# Altium schematic sheet Power.SchDoc
size A3; SheetNumber: 3; SheetTotal: 11
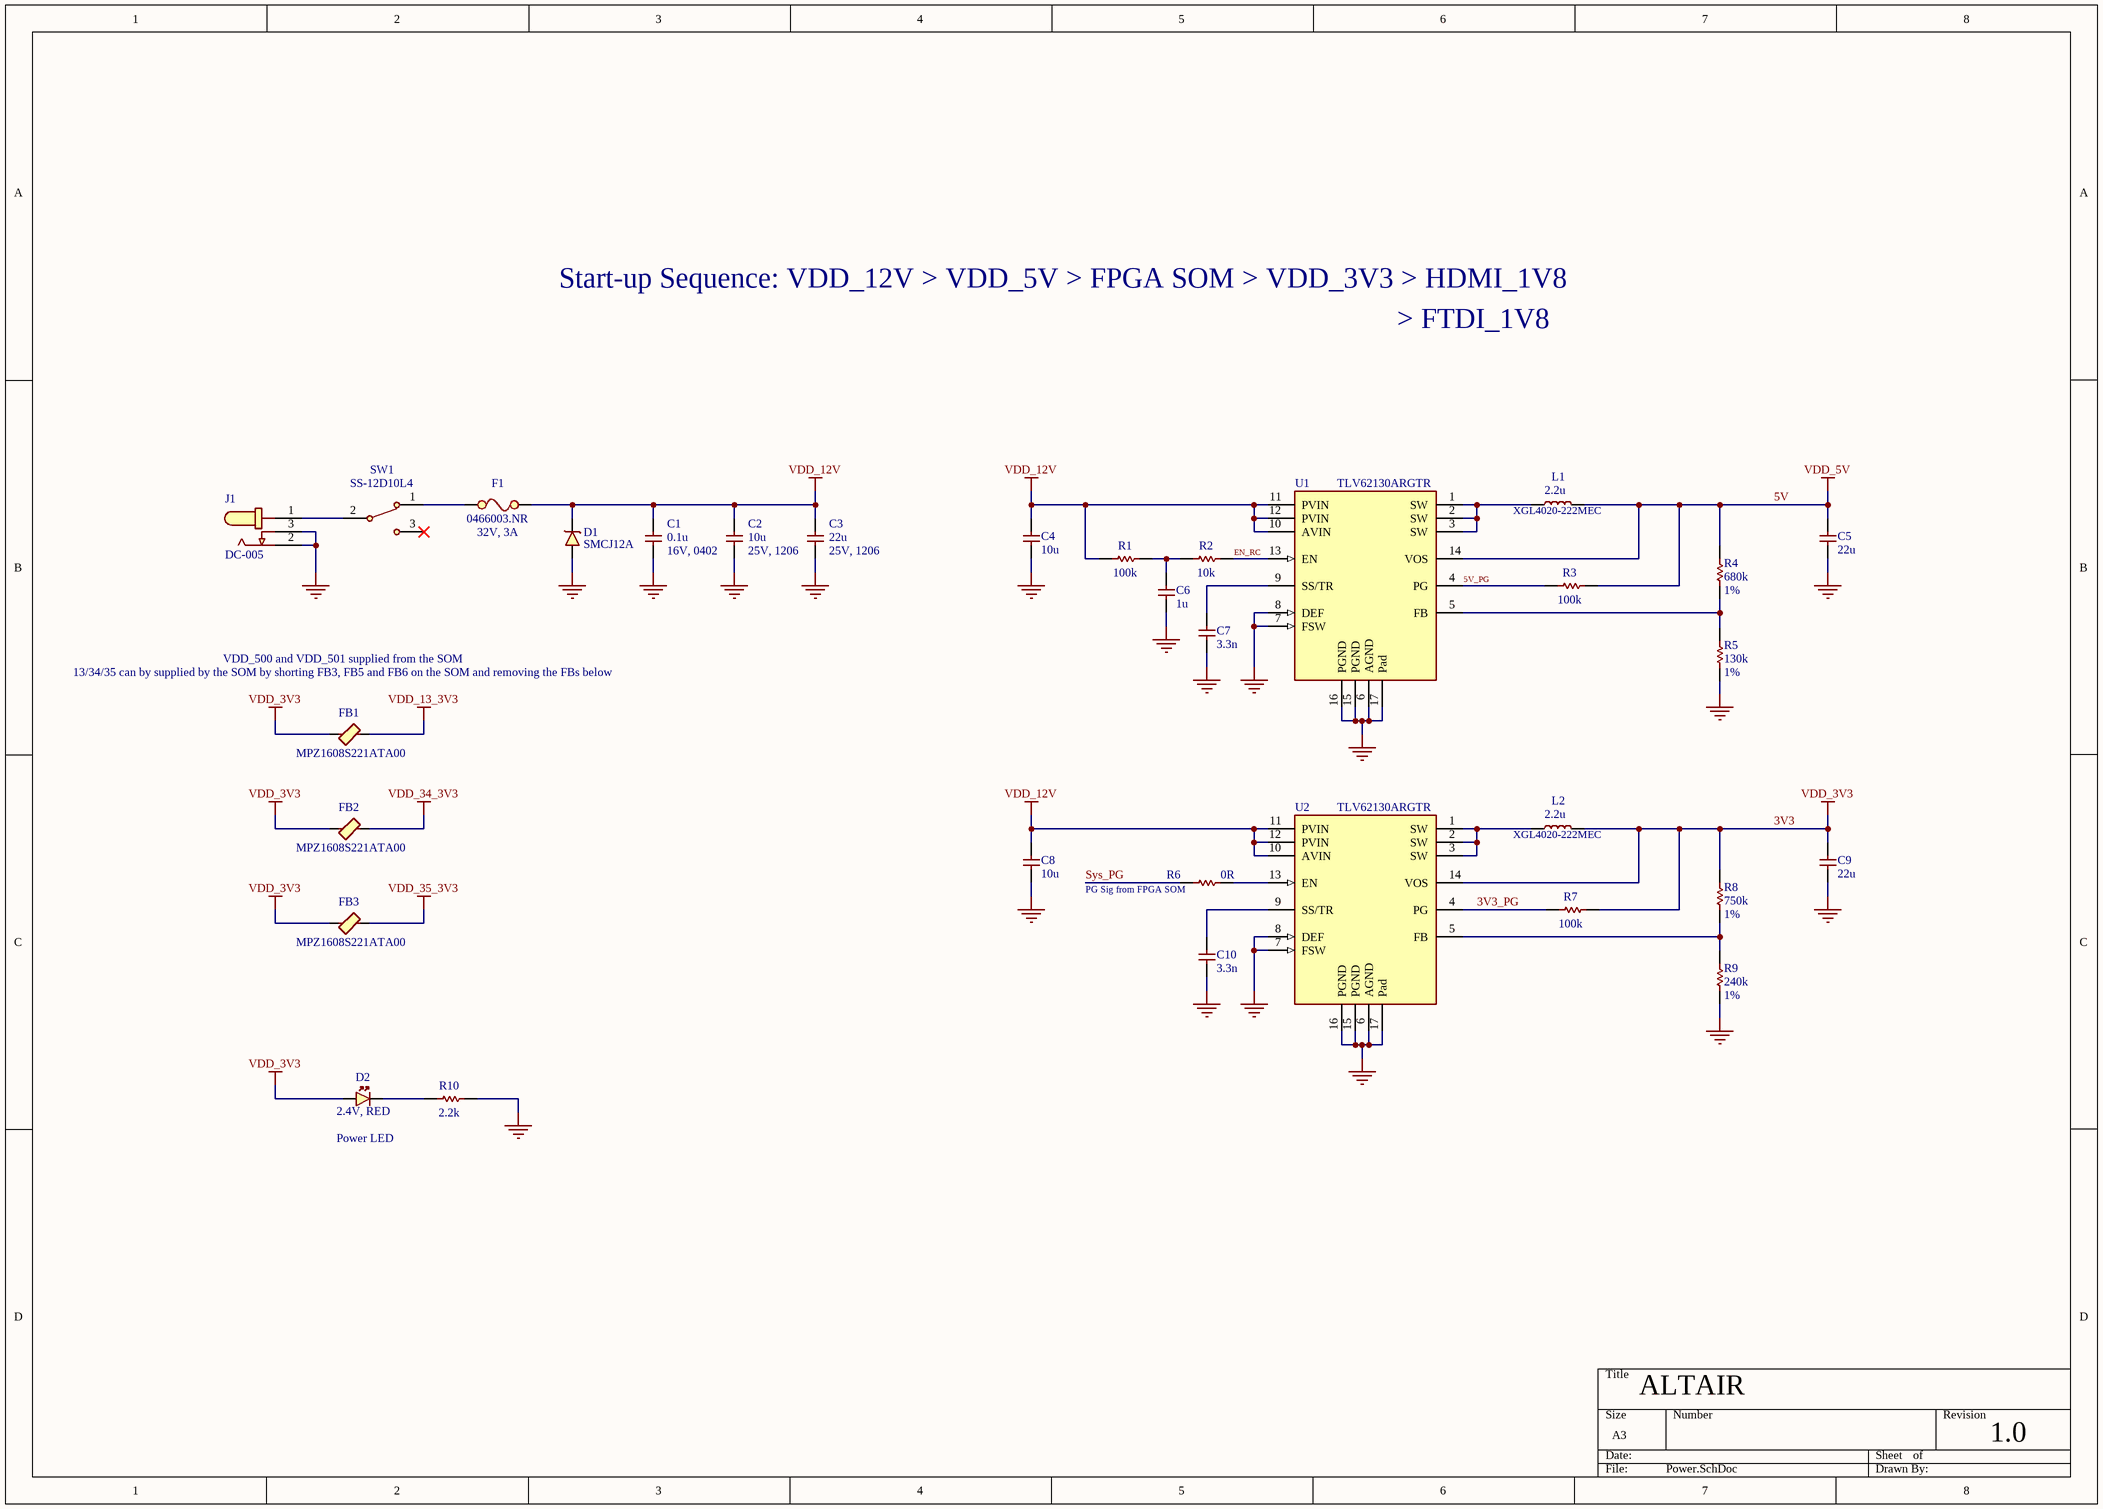
[diagram p0: Power.SchDoc]

## Parts
C1  0.1u  Note/Misc: 16V, 0402  [CAP_0402]
C2  10u  Note/Misc: 25V, 1206  [CAP_1206]
C3  22u  Note/Misc: 25V, 1206  [CAP_1206]
C4  10u  [CAP_1206]
C5  22u  [CAP_1206]
C6  1u  [CAP_0402]
C7  3.3n  [CAP_0402]
C8  10u  [CAP_1206]
C9  22u  [CAP_1206]
C10  3.3n  [CAP_0402]
D1  SMCJ12A  [LFUS-DO-214AB-2_V]
D2  Note/Misc: 2.4V, RED  [LED_0805_RED]  (hidden comment: RED)
F1  0466003.NR  Note/Misc: 32V, 3A  [0466003.NR]
FB1  220  [BEADC1608X75N]  (value not drawn)
FB2  220  [BEADC1608X75N]  (value not drawn)
FB3  220  [BEADC1608X75N]  (value not drawn)
J1  DC-005  [DC-005-A200]
L1  2.2u  Note/Misc: XGL4020-222MEC  [XGL4020222MEC]
L2  2.2u  Note/Misc: XGL4020-222MEC  [XGL4020222MEC]
R1  100k  [RES_0402]
R2  10k  [RES_0402]
R3  100k  [RES_0402]
R4  680k  Note/Misc: 1%  [RES_0402]
R5  130k  Note/Misc: 1%  [RES_0402]
R6  0R  [RES_0402]
R7  100k  [RES_0402]
R8  750k  Note/Misc: 1%  [RES_0402]
R9  240k  Note/Misc: 1%  [RES_0402]
R10  2.2k  [RES_0402]
SW1  SS-12D10L4  [SS-12D10L5]
U1  TLV62130ARGTR  [FP-RGT0016C-MFG]
U2  TLV62130ARGTR  [FP-RGT0016C-MFG]

## Nets
3V3: C9.2 D2.A FB1.1 FB2.1 FB3.1 L2.2 R7.2 R8.2 U2.14(VOS)  [also labelled VDD_3V3]
5V: C5.2 L1.2 R3.2 R4.2 U1.14(VOS)  [also labelled VDD_5V]
GND: C1.1 C2.1 C3.1 C4.1 C5.1 C6.1 C7.1 C8.1 C9.1 C10.1 D1.2 J1.2 J1.3 R5.2 R9.2 R10.2 U1.6(AGND) U1.7(FSW) U1.8(DEF) U1.15(PGND) U1.16(PGND) U1.17(Pad) U2.6(AGND) U2.7(FSW) U2.8(DEF) U2.15(PGND) U2.16(PGND) U2.17(Pad)
VDD_12V: C1.2 C2.2 C3.2 C4.2 C8.2 D1.1 F1.2 R1.2 U1.10(AVIN) U1.11(PVIN) U1.12(PVIN) U2.10(AVIN) U2.11(PVIN) U2.12(PVIN)
VDD_13_3V3: FB1.2
VDD_34_3V3: FB2.2
VDD_35_3V3: FB3.2
3V3_PG: R7.1 U2.4(PG)
5V_PG: R3.1 U1.4(PG)
EN_RC: R2.1 U1.13(EN)
Sys_PG: R6.1
NetC6_2: C6.2 R1.1 R2.2
NetC7_2: C7.2 U1.9(SS/TR)
NetC10_2: C10.2 U2.9(SS/TR)
NetD2_K: D2.K R10.1
NetF1_1: F1.1 SW1.1
NetJ1_1: J1.1 SW1.2(C)
NetL1_1: L1.1 U1.1(SW) U1.2(SW) U1.3(SW)
NetL2_1: L2.1 U2.1(SW) U2.2(SW) U2.3(SW)
NetR4_1: R4.1 R5.1 U1.5(FB)
NetR6_2: R6.2 U2.13(EN)
NetR8_1: R8.1 R9.1 U2.5(FB)

Not connected (* = marked no-connect by the designer): SW1 3*

## Notes on the sheet
- Start-up Sequence: VDD_12V > VDD_5V > FPGA SOM > VDD_3V3 > HDMI_1V8
- > FTDI_1V8
- 13/34/35 can by supplied by the SOM by shorting FB3, FB5 and FB6 on the SOM and removing the FBs below
- VDD_500 and VDD_501 supplied from the SOM
- (near R6) PG Sig from FPGA SOM
- (near D2) Power LED
- ALTAIR
- 1.0

## Library data of the parts
C1 = CAP_0402: Capacitor SMD 0402; Part No: CL05B104KO5NNNC; LCSC: *; JLCPCB Part #: C338112; Footprint JLCPCB: 0402
C2 = CAP_1206: Capacitor SMD 1206; Part No: CL31A106KAHNNNE; LCSC: *; JLCPCB Part #: C9807; Footprint JLCPCB: 1206
C3 = CAP_1206: Capacitor SMD 1206; Part No: CL31A226KAHNNNE; LCSC: *; JLCPCB Part #: C12891; Footprint JLCPCB: 1206
C4 C8 = CAP_1206: Capacitor SMD 1206; Part No: CL31A106KAHNNNE; Note/Misc: 25V, 1206; LCSC: *; JLCPCB Part #: C9807; Footprint JLCPCB: 1206
C5 C9 = CAP_1206: Capacitor SMD 1206; Part No: CL31A226KAHNNNE; Note/Misc: 25V, 1206; LCSC: *; JLCPCB Part #: C12891; Footprint JLCPCB: 1206
C6 = CAP_0402: Capacitor SMD 0402; Part No: CL05A105KP5NNNC; Note/Misc: 10V; LCSC: *; JLCPCB Part #: C14445; Footprint JLCPCB: 0402
C7 C10 = CAP_0402: Capacitor SMD 0402; Part No: CC0402JRX7R8BB332; LCSC: *; JLCPCB Part #: C527004; Footprint JLCPCB: 0402
D1 = SMCJ12A: Transient Voltage Suppression Diode, 12 V, -65 to 150 degC, 2-Pin DO-214AB (SMCJ), RoHS, Tape and Reel; Footprint JLCPCB: DO-214AB(SMCJ); JLCPCB Part #: C224038; Part No: SMCJ12A
D2 = LED_0805_RED: LED 0805 RED SMD; Part No: HL-PSC-2012S9AC; LCSC: *; Footprint JLCPCB: 0805; JLCPCB Part #: C497952
F1 = 0466003.NR: FUSE MNT 3A 32VAC/VDC 1206; JLCPCB Part #: C14165; LCSC: *; Footprint JLCPCB: 1206; Part No: 0466003.NR
FB1-FB3 = MPZ1608S221ATA00: Ferrite Bead; LCSC: *; Note/Misc: *; Part No: MPZ1608S221ATA00; JLCPCB Part #: C76815; Footprint JLCPCB: 0603
J1 = DC-005: DC Jack; Footprint JLCPCB: Plugin; JLCPCB Part #: C720557; Part No: DC-005
L1 L2 = IND_XGL4020-222MEC: Inductor SMD 2.2 uH; LCSC: *; Part No: XGL4020-222MEC; JLCPCB Part #: C6012410; Footprint JLCPCB: 1616
R1 R3 R7 = RES_0402: Resistor SMD 0402; Part No: RC0402JR-07100KL; LCSC: *; JLCPCB Part #: C106234; Footprint JLCPCB: 0402
R2 = RES_0402: Resistor SMD 0402; Part No: RC0402JR-0710KL; LCSC: *; JLCPCB Part #: C60489; Footprint JLCPCB: 0402
R4 = RES_0402: Resistor SMD 0402; Part No: RC0402FR-07680KL; LCSC: *; JLCPCB Part #: C163456; Footprint JLCPCB: 0402
R5 = RES_0402: Resistor SMD 0402; Part No: RC0402FR-07130KL; LCSC: *; JLCPCB Part #: C93946; Footprint JLCPCB: 0402
R6 = RES_0402: Resistor SMD 0402; Part No: RC0402JR-070RL; LCSC: *; JLCPCB Part #: C60485; Footprint JLCPCB: 0402
R8 = RES_0402: Resistor SMD 0402; Part No: RC0402FR-07750KL; LCSC: *; JLCPCB Part #: C137937; Footprint JLCPCB: 0402
R9 = RES_0402: Resistor SMD 0402; Part No: RC0402FR-07240KL; LCSC: *; JLCPCB Part #: C138029; Footprint JLCPCB: 0402
R10 = RES_0402: Resistor SMD 0402; Part No: RC0402JR-072K2L; LCSC: *; JLCPCB Part #: C163447; Footprint JLCPCB: 0402
SW1 = SS-12D10L5: Slide Switch; LCSC: *; Note/Misc: *; Part No: SS-12D10L4; JLCPCB Part #: C843364; Footprint JLCPCB: Plugin
U1 U2 = TLV62130ARGTR: IC REG BUCK ADJUSTABLE 3A 16QFN; JLCPCB Part #: C138520; Note/Misc: *; Footprint JLCPCB: VQFN-16-EP(3x3); Part No: TLV62130ARGTR